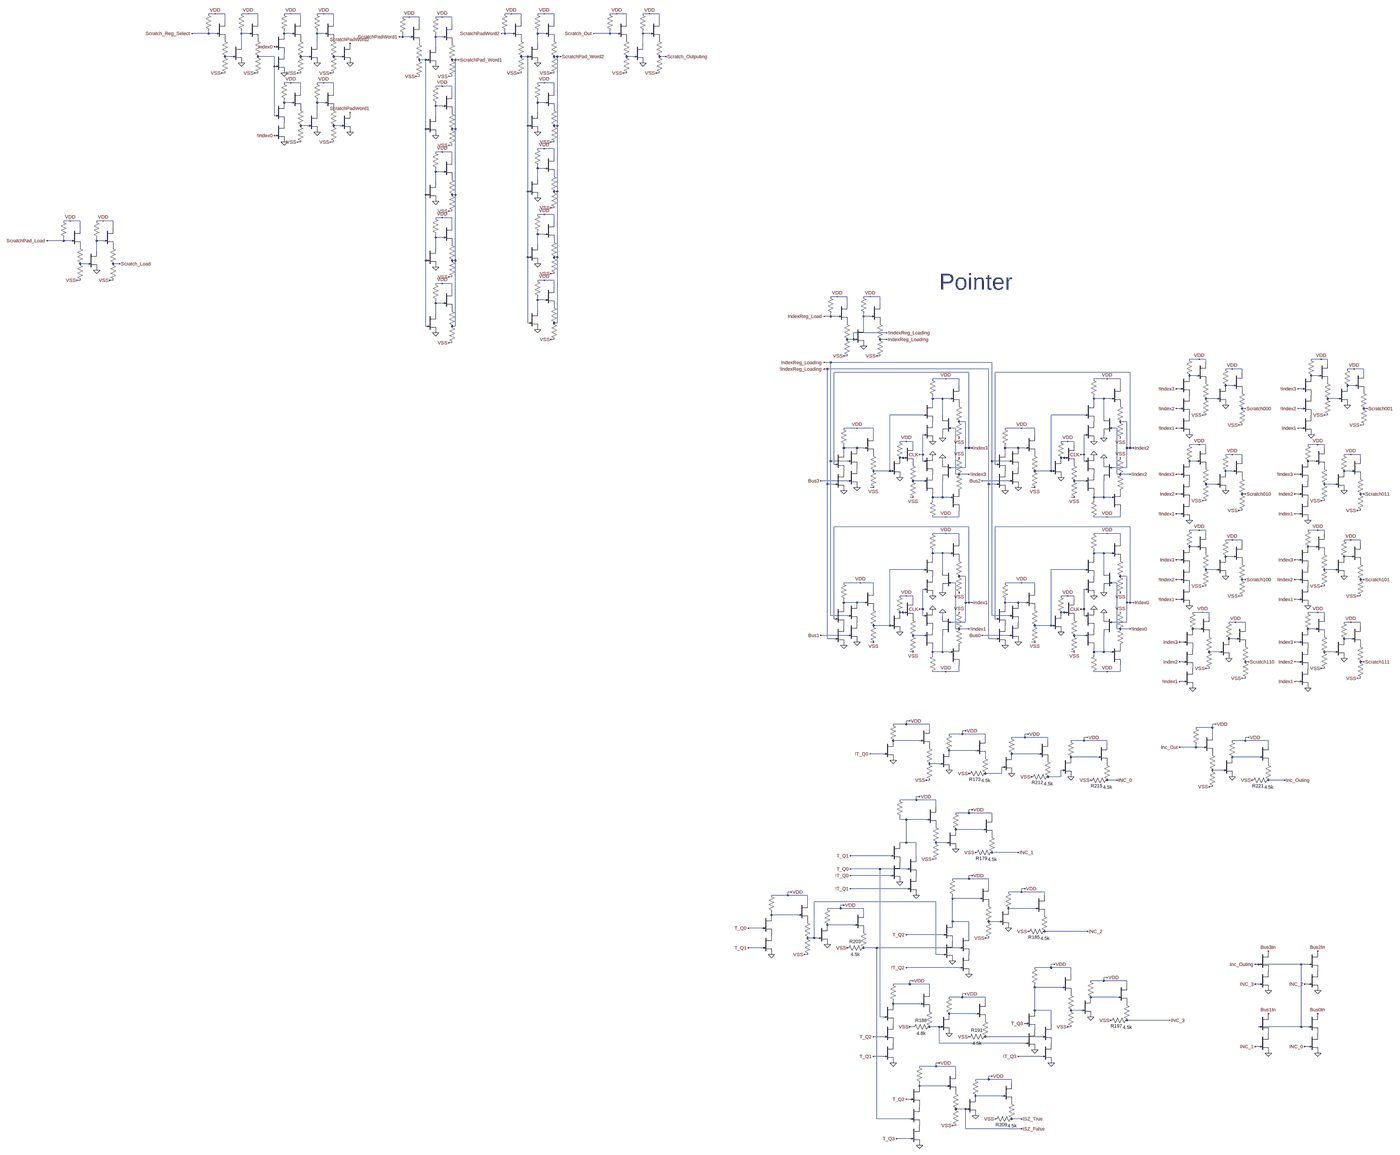
[diagram p0: schematic Controls.asc, whole sheet]
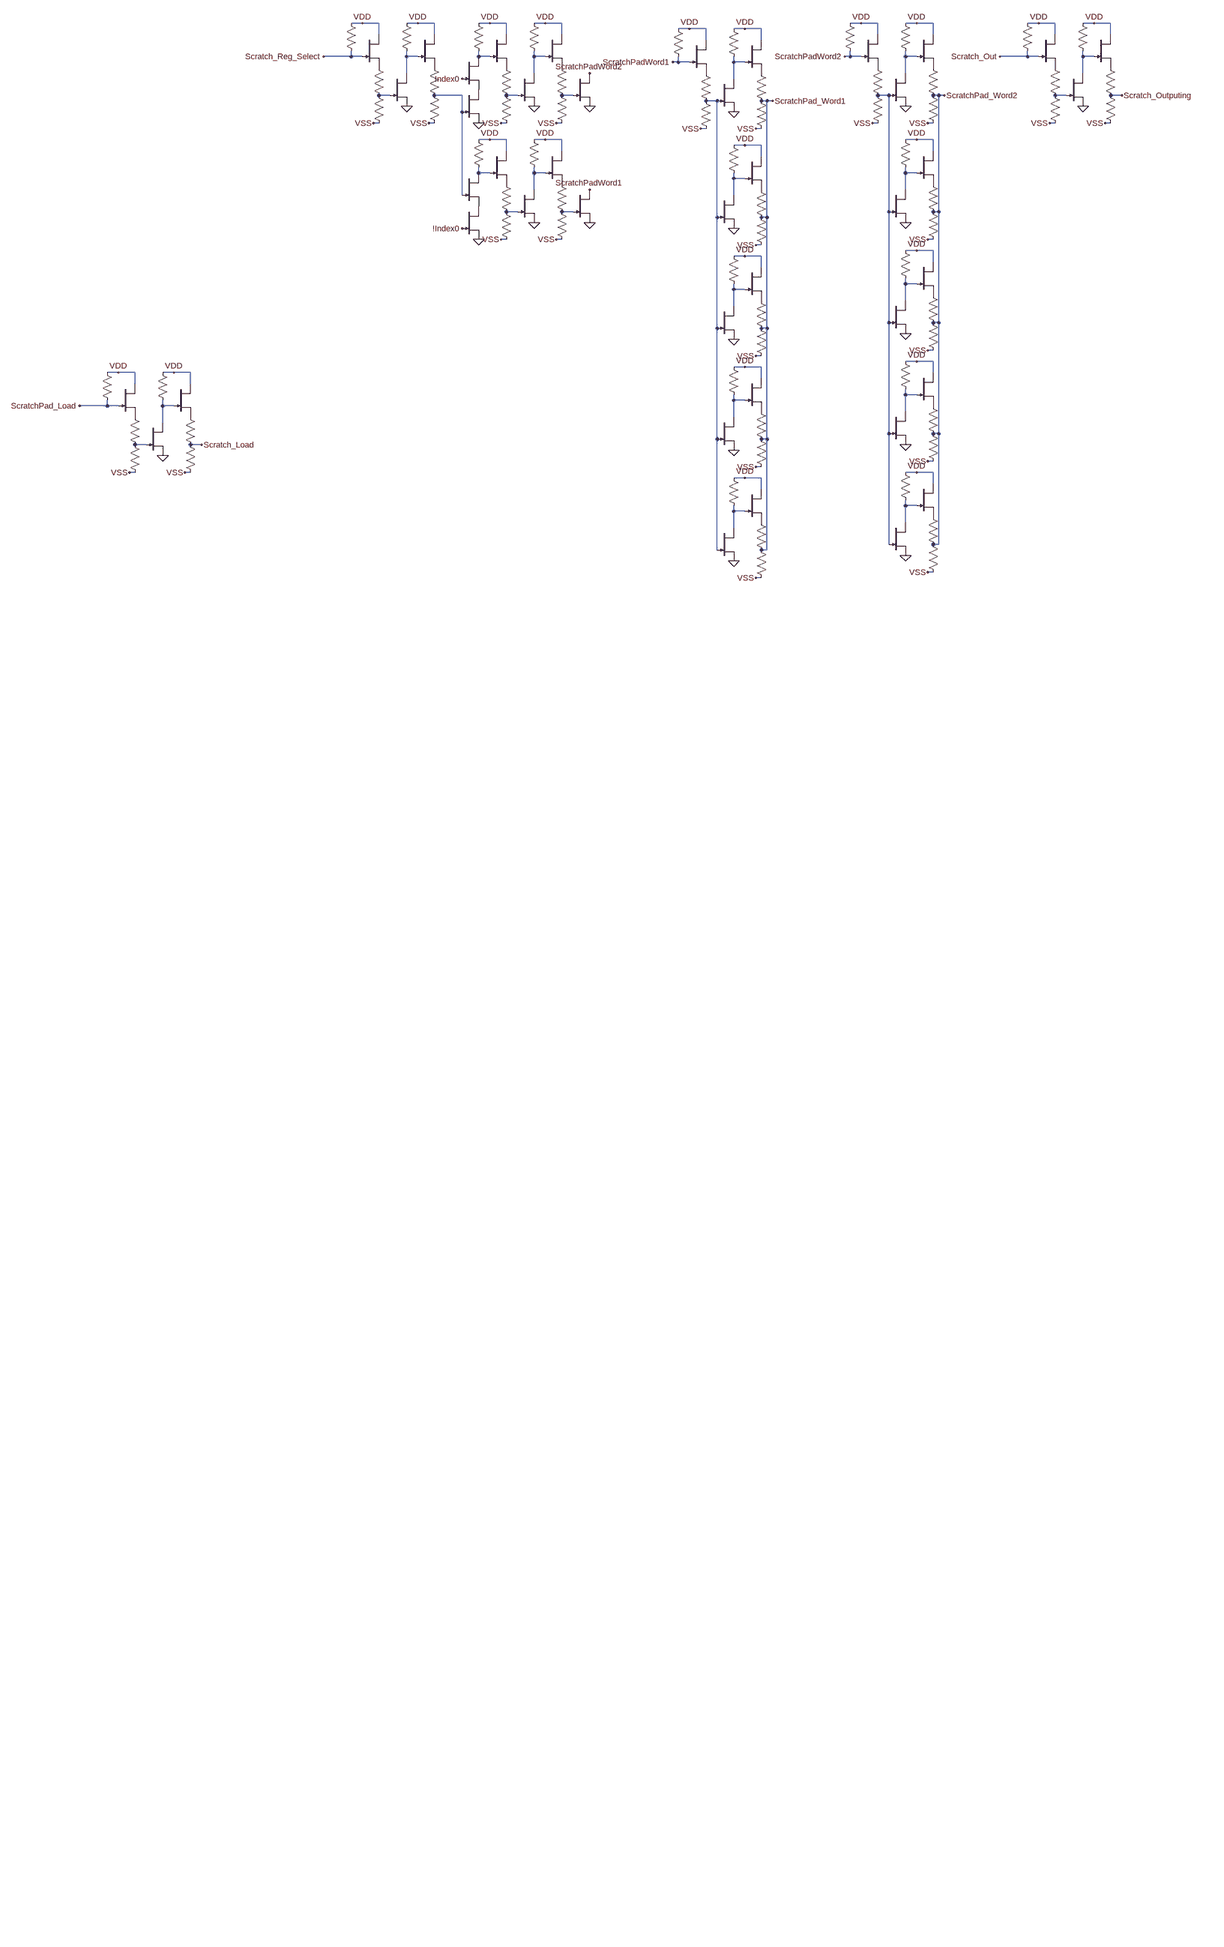
[diagram p1: schematic Controls.asc, part, row 1 of 1, column 1 of 2]
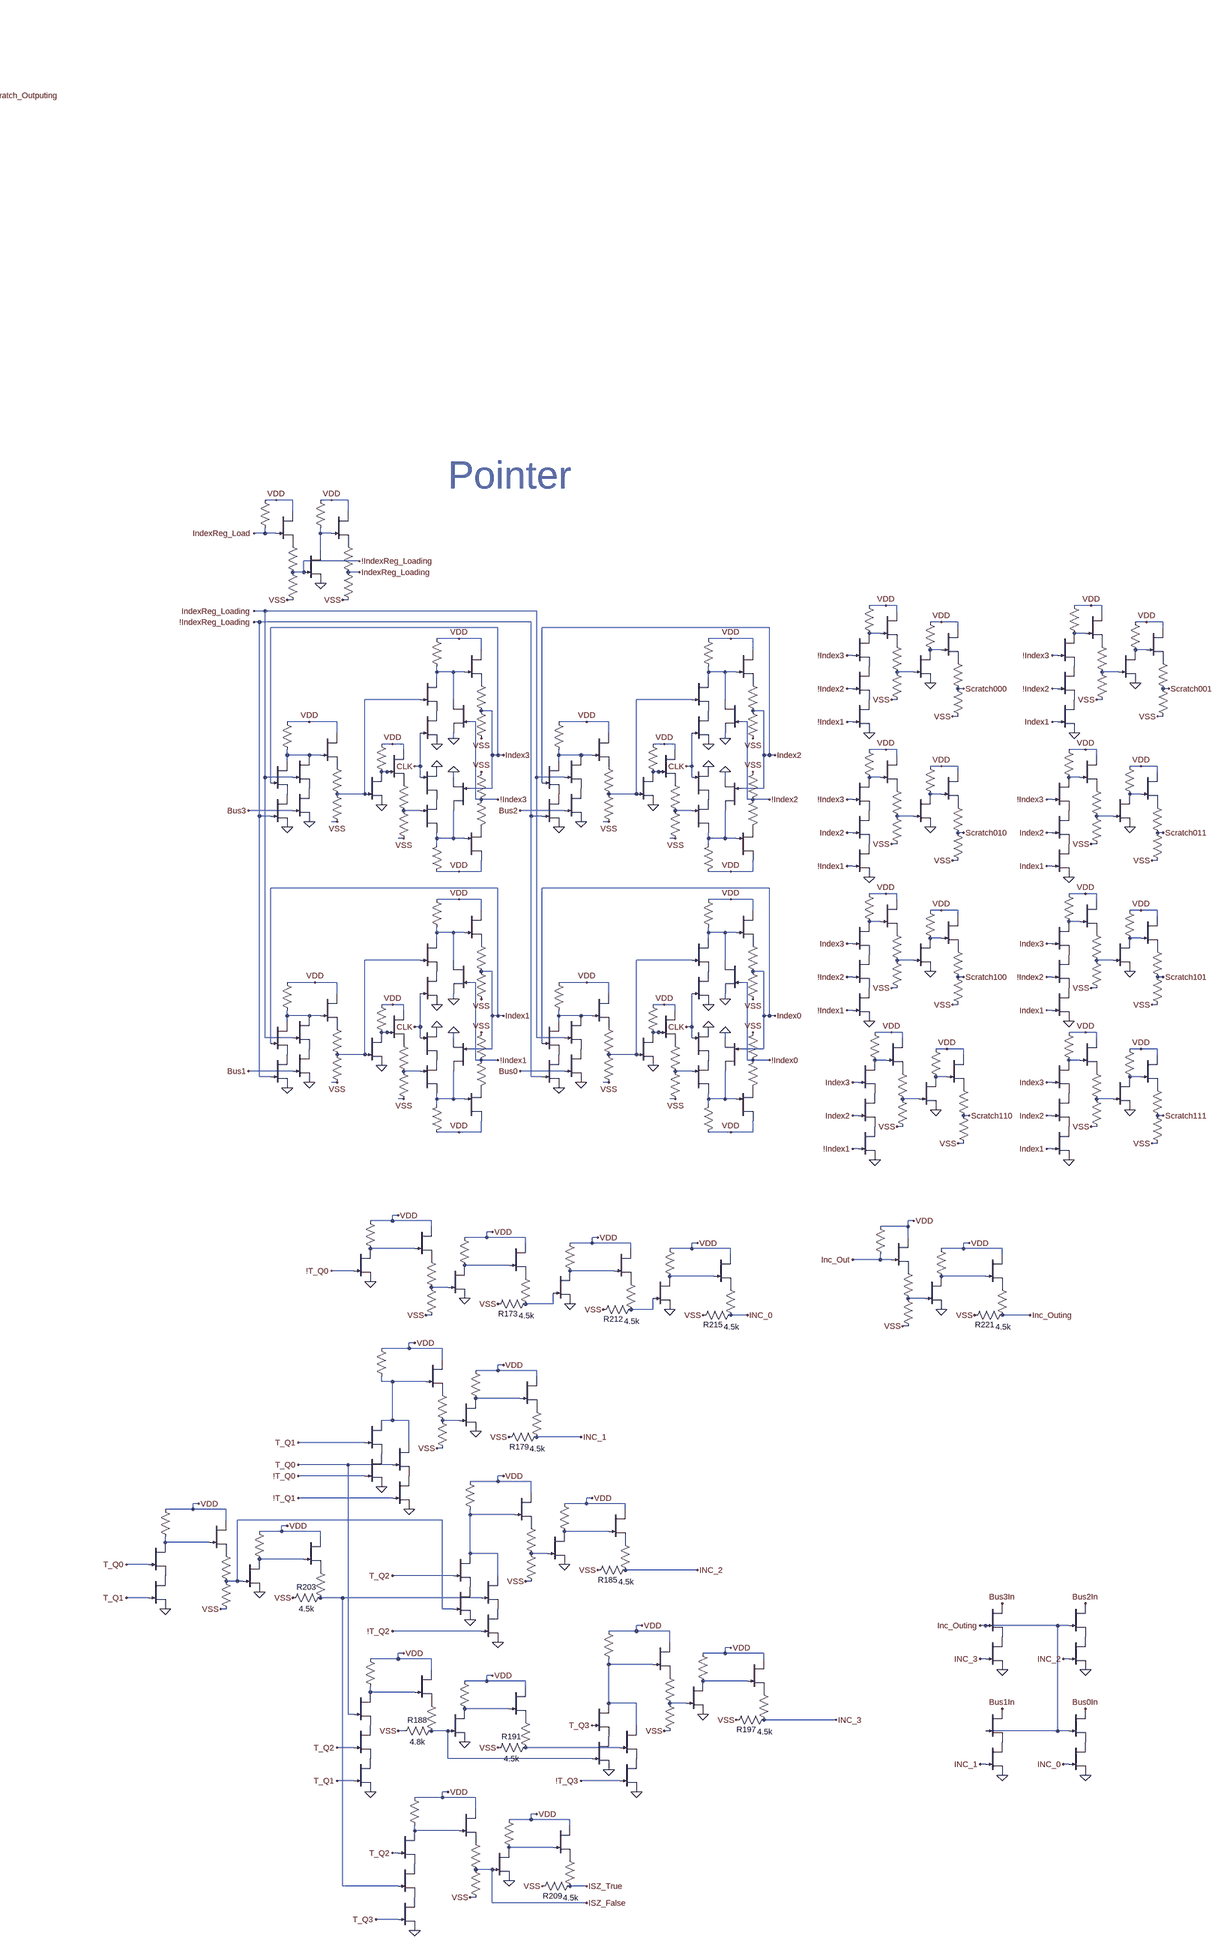
[diagram p2: schematic Controls.asc, part, row 1 of 1, column 2 of 2]
* Controls.asc
J0 N033 N037 P001 DR
R0 VDD N033 100k
J1 VDD N033 P002 DR
R1 P002 Index3 1k
R2 Index3 VSS 4.8k
J2 N033 !Index3 0 DR
J3 N051 N047 P003 DR
R3 VDD N051 100k
J4 VDD N051 P004 DR
R4 P004 !Index3 1k
R5 !Index3 VSS 4.8k
J5 N051 Index3 0 DR
J6 P001 CLK 0 DR
J7 P003 CLK 0 DR
J8 N039 Index3 P005 DR
R6 VDD N039 100k
J9 VDD N039 P006 DR
R7 P006 N037 1k
R8 N037 VSS 4.8k
J10 N039 IndexReg_Loading P007 DR
J11 N041 N037 0 DR
R9 VDD N041 50k
J12 VDD N041 P008 DR
R10 P008 N047 1k
R11 N047 VSS 4.5k
J13 P005 !IndexReg_Loading 0 DR
J14 P007 Bus3 0 DR
J15 N034 N038 P009 DR
R12 VDD N034 100k
J16 VDD N034 P010 DR
R13 P010 Index2 1k
R14 Index2 VSS 4.8k
J17 N034 !Index2 0 DR
J18 N052 N048 P011 DR
R15 VDD N052 100k
J19 VDD N052 P012 DR
R16 P012 !Index2 1k
R17 !Index2 VSS 4.8k
J20 N052 Index2 0 DR
J21 P009 CLK 0 DR
J22 P011 CLK 0 DR
J23 N040 Index2 P013 DR
R18 VDD N040 100k
J24 VDD N040 P014 DR
R19 P014 N038 1k
R20 N038 VSS 4.8k
J25 N040 IndexReg_Loading P015 DR
J26 N042 N038 0 DR
R21 VDD N042 50k
J27 VDD N042 P016 DR
R22 P016 N048 1k
R23 N048 VSS 4.5k
J28 P013 !IndexReg_Loading 0 DR
J29 P015 Bus2 0 DR
J30 N055 N059 P017 DR
R24 VDD N055 100k
J31 VDD N055 P018 DR
R25 P018 Index1 1k
R26 Index1 VSS 4.8k
J32 N055 !Index1 0 DR
J33 N073 N069 P019 DR
R27 VDD N073 100k
J34 VDD N073 P020 DR
R28 P020 !Index1 1k
R29 !Index1 VSS 4.8k
J35 N073 Index1 0 DR
J36 P017 CLK 0 DR
J37 P019 CLK 0 DR
J38 N063 Index1 P021 DR
R30 VDD N063 100k
J39 VDD N063 P022 DR
R31 P022 N059 1k
R32 N059 VSS 4.8k
J40 N063 IndexReg_Loading P023 DR
J41 N065 N059 0 DR
R33 VDD N065 50k
J42 VDD N065 P024 DR
R34 P024 N069 1k
R35 N069 VSS 4.5k
J43 P021 !IndexReg_Loading 0 DR
J44 P023 Bus1 0 DR
J45 N056 N060 P025 DR
R36 VDD N056 100k
J46 VDD N056 P026 DR
R37 P026 Index0 1k
R38 Index0 VSS 4.8k
J47 N056 !Index0 0 DR
J48 N074 N070 P027 DR
R39 VDD N074 100k
J49 VDD N074 P028 DR
R40 P028 !Index0 1k
R41 !Index0 VSS 4.8k
J50 N074 Index0 0 DR
J51 P025 CLK 0 DR
J52 P027 CLK 0 DR
J53 N064 Index0 P029 DR
R42 VDD N064 100k
J54 VDD N064 P030 DR
R43 P030 N060 1k
R44 N060 VSS 4.8k
J55 N064 IndexReg_Loading P031 DR
J56 N066 N060 0 DR
R45 VDD N066 50k
J57 VDD N066 P032 DR
R46 P032 N070 1k
R47 N070 VSS 4.5k
J58 P029 !IndexReg_Loading 0 DR
J59 P031 Bus0 0 DR
R48 VDD ScratchPad_Load 100k
J60 VDD ScratchPad_Load P033 DR
R49 P033 N025 1k
R50 N025 VSS 4.8k
J61 N024 N025 0 DR
R51 VDD N024 50k
J62 VDD N024 P034 DR
R52 P034 Scratch_Load 1k
R53 VSS Scratch_Load 4.5k
J63 N029 !Index3 P035 DR
R54 VDD N029 100k
J64 VDD N029 P036 DR
R55 P036 N035 1k
R56 N035 VSS 4.8k
J65 P035 !Index2 P037 DR
J66 N031 N035 0 DR
R57 VDD N031 50k
J67 VDD N031 P038 DR
R58 P038 Scratch000 1k
R59 VSS Scratch000 4.5k
J68 P037 !Index1 0 DR
J69 N043 !Index3 P039 DR
R60 VDD N043 100k
J70 VDD N043 P040 DR
R61 P040 N049 1k
R62 N049 VSS 4.8k
J71 P039 Index2 P041 DR
J72 N045 N049 0 DR
R63 VDD N045 50k
J73 VDD N045 P042 DR
R64 P042 Scratch010 1k
R65 VSS Scratch010 4.5k
J74 P041 !Index1 0 DR
J75 N053 Index3 P043 DR
R66 VDD N053 100k
J76 VDD N053 P044 DR
R67 P044 N061 1k
R68 N061 VSS 4.8k
J77 P043 !Index2 P045 DR
J78 N057 N061 0 DR
R69 VDD N057 50k
J79 VDD N057 P046 DR
R70 P046 Scratch100 1k
R71 VSS Scratch100 4.5k
J80 P045 !Index1 0 DR
J81 N067 Index3 P047 DR
R72 VDD N067 100k
J82 VDD N067 P048 DR
R73 P048 N075 1k
R74 N075 VSS 4.8k
J83 P047 Index2 P049 DR
J84 N071 N075 0 DR
R75 VDD N071 50k
J85 VDD N071 P050 DR
R76 P050 Scratch110 1k
R77 VSS Scratch110 4.5k
J86 P049 !Index1 0 DR
J87 N068 Index3 P051 DR
R78 VDD N068 100k
J88 VDD N068 P052 DR
R79 P052 N076 1k
R80 N076 VSS 4.8k
J89 P051 Index2 P053 DR
J90 N072 N076 0 DR
R81 VDD N072 50k
J91 VDD N072 P054 DR
R82 P054 Scratch111 1k
R83 VSS Scratch111 4.5k
J92 P053 Index1 0 DR
J93 N054 Index3 P055 DR
R84 VDD N054 100k
J94 VDD N054 P056 DR
R85 P056 N062 1k
R86 N062 VSS 4.8k
J95 P055 !Index2 P057 DR
J96 N058 N062 0 DR
R87 VDD N058 50k
J97 VDD N058 P058 DR
R88 P058 Scratch101 1k
R89 VSS Scratch101 4.5k
J98 P057 Index1 0 DR
J99 N044 !Index3 P059 DR
R90 VDD N044 100k
J100 VDD N044 P060 DR
R91 P060 N050 1k
R92 N050 VSS 4.8k
J101 P059 Index2 P061 DR
J102 N046 N050 0 DR
R93 VDD N046 50k
J103 VDD N046 P062 DR
R94 P062 Scratch011 1k
R95 VSS Scratch011 4.5k
J104 P061 Index1 0 DR
J105 N030 !Index3 P063 DR
R96 VDD N030 100k
J106 VDD N030 P064 DR
R97 P064 N036 1k
R98 N036 VSS 4.8k
J107 P063 !Index2 P065 DR
J108 N032 N036 0 DR
R99 VDD N032 50k
J109 VDD N032 P066 DR
R100 P066 Scratch001 1k
R101 VSS Scratch001 4.5k
J110 P065 Index1 0 DR
R102 VDD Scratch_Out 100k
J111 VDD Scratch_Out P067 DR
R103 P067 N012 1k
R104 N012 VSS 4.8k
J112 N005 N012 0 DR
R105 VDD N005 50k
J113 VDD N005 P068 DR
R106 P068 Scratch_Outputing 1k
R107 VSS Scratch_Outputing 4.5k
R108 VDD Scratch_Reg_Select 100k
J114 VDD Scratch_Reg_Select P069 DR
R109 P069 N007 1k
R110 N007 VSS 4.8k
J115 N001 N007 0 DR
R111 VDD N001 50k
J116 VDD N001 P070 DR
R112 P070 N008 1k
R113 VSS N008 4.5k
R114 VDD N002 100k
J117 VDD N002 P071 DR
R115 P071 N009 1k
R116 N009 VSS 4.8k
J118 N003 N009 0 DR
R117 VDD N003 50k
J119 VDD N003 P072 DR
R118 P072 N010 1k
R119 VSS N010 4.5k
J120 N002 Index0 P073 DR
J121 P073 N008 0 DR
R120 VDD N014 100k
J122 VDD N014 P074 DR
R121 P074 N018 1k
R122 N018 VSS 4.8k
J123 N015 N018 0 DR
R123 VDD N015 50k
J124 VDD N015 P075 DR
R124 P075 N019 1k
R125 VSS N019 4.5k
J125 N014 N008 P076 DR
J126 P076 !Index0 0 DR
J127 ScratchPadWord2 N010 0 DR
J128 ScratchPadWord1 N019 0 DR
R126 VDD ScratchPadWord1 100k
J129 VDD ScratchPadWord1 P077 DR
R127 P077 N013 1k
R128 N013 VSS 4.8k
J130 N006 N013 0 DR
R129 VDD N006 50k
J131 VDD N006 P078 DR
R130 P078 ScratchPad_Word1 1k
R131 VSS ScratchPad_Word1 4.5k
R132 VDD ScratchPadWord2 100k
J132 VDD ScratchPadWord2 P079 DR
R133 P079 N011 1k
R134 N011 VSS 4.8k
J133 N004 N011 0 DR
R135 VDD N004 50k
J134 VDD N004 P080 DR
R136 P080 ScratchPad_Word2 1k
R137 VSS ScratchPad_Word2 4.5k
R138 VDD IndexReg_Load 100k
J135 VDD IndexReg_Load P081 DR
R139 P081 !IndexReg_Loading 1k
R140 !IndexReg_Loading VSS 4.8k
J136 N028 !IndexReg_Loading 0 DR
R141 VDD N028 50k
J137 VDD N028 P082 DR
R142 P082 IndexReg_Loading 1k
R143 VSS IndexReg_Loading 4.5k
J138 N017 N013 0 DR
R144 VDD N017 50k
J139 VDD N017 P083 DR
R145 P083 ScratchPad_Word1 1k
R146 VSS ScratchPad_Word1 4.5k
J140 N021 N013 0 DR
R147 VDD N021 50k
J141 VDD N021 P084 DR
R148 P084 ScratchPad_Word1 1k
R149 VSS ScratchPad_Word1 4.5k
J142 N023 N013 0 DR
R150 VDD N023 50k
J143 VDD N023 P085 DR
R151 P085 ScratchPad_Word1 1k
R152 VSS ScratchPad_Word1 4.5k
J144 N027 N013 0 DR
R153 VDD N027 50k
J145 VDD N027 P086 DR
R154 P086 ScratchPad_Word1 1k
R155 VSS ScratchPad_Word1 4.5k
J146 N016 N011 0 DR
R156 VDD N016 50k
J147 VDD N016 P087 DR
R157 P087 ScratchPad_Word2 1k
R158 VSS ScratchPad_Word2 4.5k
J148 N020 N011 0 DR
R159 VDD N020 50k
J149 VDD N020 P088 DR
R160 P088 ScratchPad_Word2 1k
R161 VSS ScratchPad_Word2 4.5k
J150 N022 N011 0 DR
R162 VDD N022 50k
J151 VDD N022 P089 DR
R163 P089 ScratchPad_Word2 1k
R164 VSS ScratchPad_Word2 4.5k
J152 N026 N011 0 DR
R165 VDD N026 50k
J153 VDD N026 P090 DR
R166 P090 ScratchPad_Word2 1k
R167 VSS ScratchPad_Word2 4.5k
J154 N077 !T_Q0 0 DR
R168 VDD N077 100k
J155 VDD N077 P091 DR
R169 P091 N082 1k
R170 N082 VSS 4.8k
J156 N078 N082 0 DR
R171 VDD N078 50k
J157 VDD N078 P092 DR
R172 P092 N084 1k
R173 N084 VSS 4.5k
J158 N086 T_Q1 P093 DR
R174 VDD N086 100k
J159 VDD N086 P094 DR
R175 P094 N088 1k
R176 N088 VSS 4.8k
J160 N086 T_Q0 P095 DR
J161 N087 N088 0 DR
R177 VDD N087 50k
J162 VDD N087 P096 DR
R178 P096 INC_1 1k
R179 INC_1 VSS 4.5k
J163 P093 !T_Q0 0 DR
J164 P095 !T_Q1 0 DR
J165 N089 T_Q2 P097 DR
R180 VDD N089 100k
J166 VDD N089 P098 DR
R181 P098 N093 1k
R182 N093 VSS 4.8k
J167 N089 N095 P099 DR
J168 N091 N093 0 DR
R183 VDD N091 50k
J169 VDD N091 P100 DR
R184 P100 INC_2 1k
R185 INC_2 VSS 4.5k
J170 P097 N090 0 DR
J171 P099 !T_Q2 0 DR
R186 VDD N098 100k
J172 VDD N098 P101 DR
R187 P101 N101 1k
R188 N101 VSS 4.8k
J173 N100 N101 0 DR
R189 VDD N100 50k
J174 VDD N100 P102 DR
R190 P102 N102 1k
R191 N102 VSS 4.5k
J175 P103 T_Q1 0 DR
J176 P104 T_Q2 P103 DR
J177 N098 T_Q0 P104 DR
J178 N096 T_Q3 P105 DR
R192 VDD N096 100k
J179 VDD N096 P106 DR
R193 P106 N099 1k
R194 N099 VSS 4.8k
J180 N096 N102 P107 DR
J181 N097 N099 0 DR
R195 VDD N097 50k
J182 VDD N097 P108 DR
R196 P108 INC_3 1k
R197 INC_3 VSS 4.5k
J183 P105 N101 0 DR
J184 P107 !T_Q3 0 DR
J185 N092 T_Q0 P109 DR
R198 VDD N092 100k
J186 VDD N092 P110 DR
R199 P110 N090 1k
R200 N090 VSS 4.8k
J187 N094 N090 0 DR
R201 VDD N094 50k
J188 VDD N094 P111 DR
R202 P111 N095 1k
R203 N095 VSS 4.5k
J189 P109 T_Q1 0 DR
J190 N103 T_Q2 P112 DR
J191 P112 N095 P113 DR
R204 VDD N103 100k
J192 VDD N103 P114 DR
R205 P114 ISZ_False 1k
R206 ISZ_False VSS 4.8k
J193 N104 ISZ_False 0 DR
R207 VDD N104 50k
J194 VDD N104 P115 DR
R208 P115 ISZ_True 1k
R209 ISZ_True VSS 4.5k
J195 P113 T_Q3 0 DR
J196 N079 N084 0 DR
R210 VDD N079 50k
J197 VDD N079 P116 DR
R211 P116 N085 1k
R212 N085 VSS 4.5k
J198 N080 N085 0 DR
R213 VDD N080 50k
J199 VDD N080 P117 DR
R214 P117 INC_0 1k
R215 INC_0 VSS 4.5k
J200 P118 INC_3 0 DR
J201 Bus3In Inc_Outing P118 DR
J202 P119 INC_2 0 DR
J203 Bus2In Inc_Outing P119 DR
J204 P120 INC_1 0 DR
J205 Bus1In Inc_Outing P120 DR
J206 P121 INC_0 0 DR
J207 Bus0In Inc_Outing P121 DR
R216 VDD Inc_Out 100k
J208 VDD Inc_Out P122 DR
R217 P122 N083 1k
R218 N083 VSS 4.8k
J209 N081 N083 0 DR
R219 VDD N081 50k
J210 VDD N081 P123 DR
R220 P123 Inc_Outing 1k
R221 Inc_Outing VSS 4.5k
.model NJF NJF
.model PJF PJF
.lib standard.jft
* Pointer
.backanno
.end